# EAGLE schematic Station_lithobius_motenio_usb. (EAGLE 9.5.2)
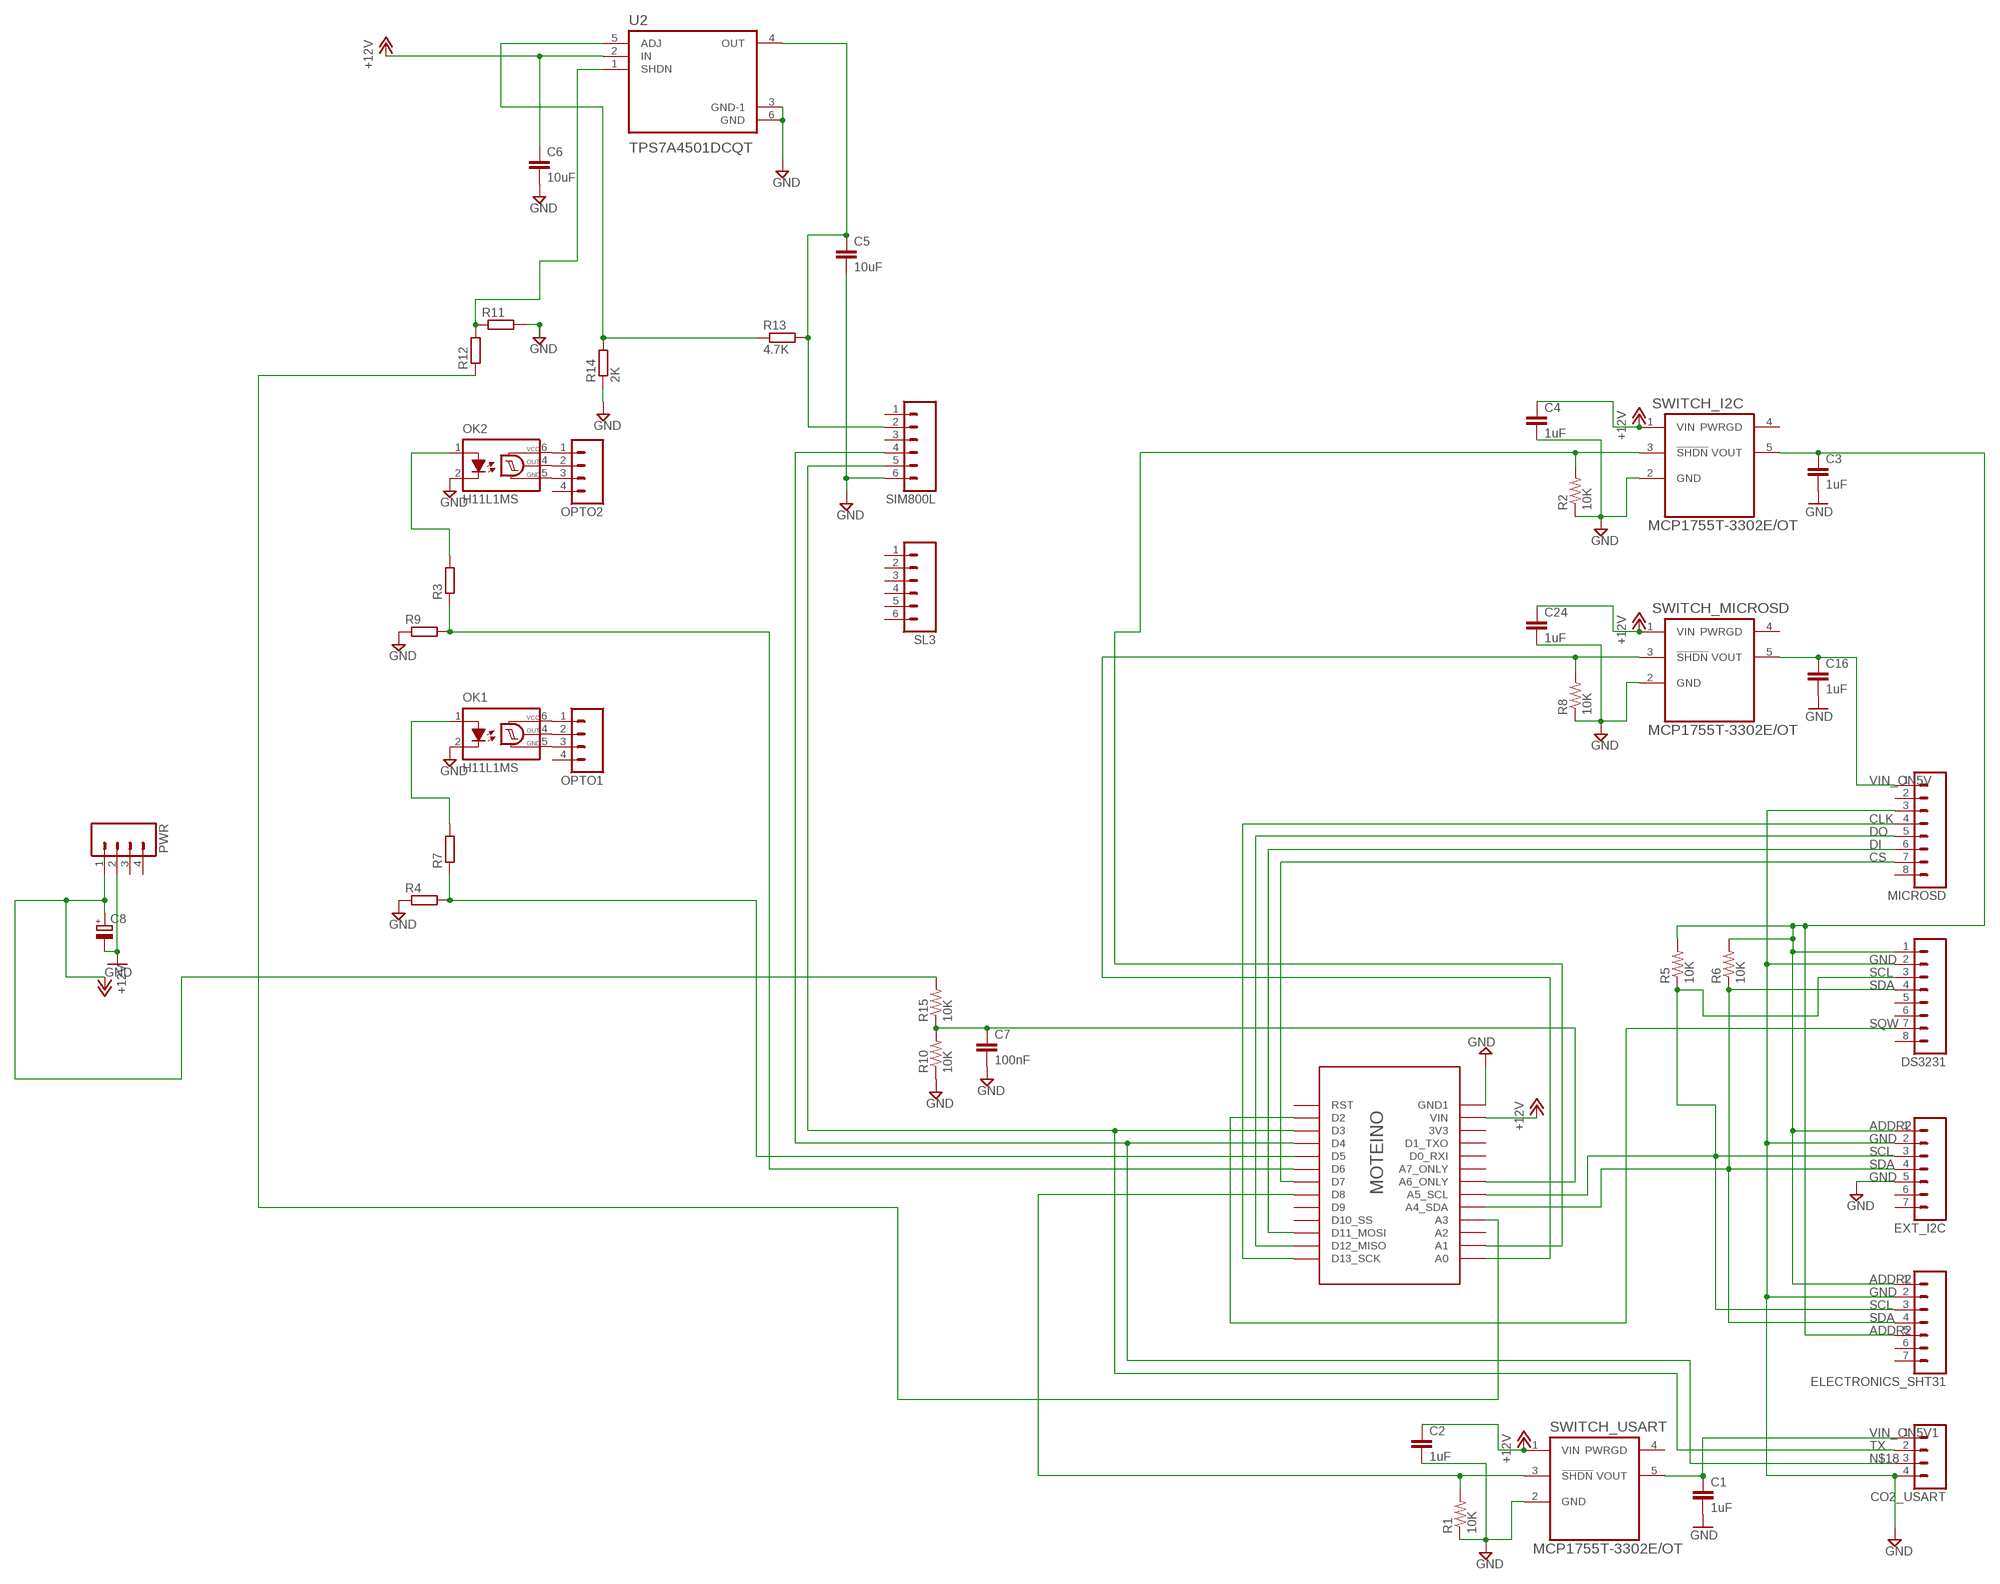
[diagram p0: schematic, sheet 1]

## Parts
C1  1uF  C-EUC0805K  [C0805K]
C2  1uF  C-EUC0805K  [C0805K]
C3  1uF  C-EUC0805K  [C0805K]
C4  1uF  C-EUC0805K  [C0805K]
C5  10uF  C-EUC0805K  [C0805K]
C6  10uF  C-EUC0805K  [C0805K]
C7  100nF  C-EUC0805K  [C0805K]
C8  CPOL-EU153CLV-0810  [153CLV-0810]
C16  1uF  C-EUC0805K  [C0805K]
C24  1uF  C-EUC0805K  [C0805K]
CO2_USART  M04  [04P]
DS3231  M08  [08P]
ELECTRONICS_SHT31  M07  [07P]
EXT_I2C  M07  [07P]
MICROSD  M08  [08P]
OK1  H11L1MS  [DIL6-SMD]
OK2  H11L1MS  [DIL6-SMD]
OPTO1  M04  [04P]
OPTO2  M04  [04P]
PWR  M04  [04P]
R1  10K  R-US_R2012W  [R2012W]
R2  10K  R-US_R2012W  [R2012W]
R3  R-EU_R0805  [R0805]
R4  R-EU_R0805  [R0805]
R5  10K  R-US_R2012W  [R2012W]
R6  10K  R-US_R2012W  [R2012W]
R7  R-EU_R0805  [R0805]
R8  10K  R-US_R2012W  [R2012W]
R9  R-EU_R0805  [R0805]
R10  10K  R-US_R2012W  [R2012W]
R11  R-EU_R0805  [R0805]
R12  R-EU_R0805  [R0805]
R13  4.7K  R-EU_R0805  [R0805]
R14  2K  R-EU_R0805  [R0805]
R15  10K  R-US_R2012W  [R2012W]
SIM800L  M06  [06P]
SL3  M06  [06P]
SWITCH_I2C  MCP1755T-3302E/OT  [SOT95P270X145-5N]
SWITCH_MICROSD  MCP1755T-3302E/OT  [SOT95P270X145-5N]
SWITCH_USART  MCP1755T-3302E/OT  [SOT95P270X145-5N]
U2  TPS7A4501DCQT  [SOT127P706X180-6N]
U$1  MOTEINO_SIMPLE  [MOTEINO_SIMPLE]

## Nets
+12V: C2.1 C4.1 C6.1 C8.+ C24.1 PWR.1 R15.2 SWITCH_I2C.1(VIN) SWITCH_MICROSD.1(VIN) SWITCH_USART.1(VIN) U2.2(IN) U$1.VIN
ADDR2: C3.1 DS3231.1 ELECTRONICS_SHT31.1 ELECTRONICS_SHT31.5 EXT_I2C.1 R5.2 R6.2 SWITCH_I2C.5(VOUT)
CLK: MICROSD.4 U$1.D13_SCK
CS: MICROSD.7 U$1.D7
DI: MICROSD.6 U$1.D11_MOSI
DO: MICROSD.5 U$1.D12_MISO
GND: C1.2 C2.2 C3.2 C4.2 C5.2 C6.2 C7.2 C8.- C16.2 C24.2 CO2_USART.4 DS3231.2 ELECTRONICS_SHT31.2 EXT_I2C.2 EXT_I2C.5 MICROSD.3 OK1.2(C) OK2.2(C) PWR.2 R1.1 R2.1 R4.1 R8.1 R9.1 R10.1 R11.2 R14.1 SIM800L.6 SWITCH_I2C.2(GND) SWITCH_MICROSD.2(GND) SWITCH_USART.2(GND) U2.3(GND-1) U2.6(GND) U$1.GND1
N$1: R11.1 R12.2 U2.1(SHDN)
N$2: R2.2 SWITCH_I2C.3(!SHDN) U$1.A1
N$3: R4.2 R7.1 U$1.D5
N$4: OK1.6(VCC) OPTO1.1
N$5: C7.1 R10.2 R15.1 U$1.A6_ONLY
N$6: R1.2 SWITCH_USART.3(!SHDN) U$1.D8
N$7: R3.1 R9.2 U$1.D6
N$8: OK1.4(OUT) OPTO1.2
N$9: OK1.5(GND) OPTO1.3
N$10: OK1.1(A) R7.2
N$11: R12.1 U$1.A3
N$12: OK2.6(VCC) OPTO2.1
N$13: OK2.4(OUT) OPTO2.2
N$15: C5.1 R13.2 SIM800L.2 U2.4(OUT)
N$16: R13.1 R14.2 U2.5(ADJ)
N$18: CO2_USART.3 SIM800L.4 U$1.D4
N$21: OK2.5(GND) OPTO2.3
N$25: OK2.1(A) R3.2
N$42: R8.2 SWITCH_MICROSD.3(!SHDN) U$1.A0
SCL: DS3231.3 ELECTRONICS_SHT31.3 EXT_I2C.3 R5.1 U$1.A5_SCL
SDA: DS3231.4 ELECTRONICS_SHT31.4 EXT_I2C.4 R6.1 U$1.A4_SDA
SQW: DS3231.7 U$1.D2
TX: CO2_USART.2 SIM800L.5 U$1.D3
VIN_ON5V: C16.1 MICROSD.1 SWITCH_MICROSD.5(VOUT)
VIN_ON5V1: C1.1 CO2_USART.1 SWITCH_USART.5(VOUT)
Unconnected: DS3231.5 DS3231.6 DS3231.8 ELECTRONICS_SHT31.6 ELECTRONICS_SHT31.7 EXT_I2C.6 EXT_I2C.7 MICROSD.2 MICROSD.8 OPTO1.4 OPTO2.4 PWR.3 PWR.4 SIM800L.1 SIM800L.3 SL3.1 SL3.2 SL3.3 SL3.4 SL3.5 SL3.6 SWITCH_I2C.4(PWRGD) SWITCH_MICROSD.4(PWRGD) SWITCH_USART.4(PWRGD) U$1.3V3 U$1.A2 U$1.A7_ONLY U$1.D0_RXI U$1.D1_TXO U$1.D9 U$1.D10_SS U$1.RST

## Library data of the parts
C1-C7 C16 C24 = resistor:C-EU: CAPACITOR, European symbol
C8 = resistor:CPOL-EU: POLARIZED CAPACITOR, European symbol
CO2_USART OPTO1 OPTO2 PWR = con-amp-quick:M04: AMP QUICK CONNECTOR; OC_FARNELL: unknown; OC_NEWARK: unknown
DS3231 MICROSD = con-amp-quick:M08: AMP QUICK CONNECTOR; OC_FARNELL: unknown; OC_NEWARK: unknown
ELECTRONICS_SHT31 EXT_I2C = con-amp-quick:M07: AMP QUICK CONNECTOR; OC_FARNELL: unknown; OC_NEWARK: unknown
OK1 OK2 = optocoupler:H11L*M: 6-Pin DIP Optocoupler Source: http://www.fairchildsemi.com/ds/H1/H11L2-M.pdf; OC_FARNELL: unknown; OC_NEWARK: unknown
R1 R2 R5 R6 R8 R10 R15 = resistor:R-US_: RESISTOR, American symbol
R3 R4 R7 R9 R11-R14 = rcl:R-EU_: RESISTOR, European symbol; SPICEPREFIX: R
SIM800L SL3 = con-amp-quick:M06: AMP QUICK CONNECTOR; OC_FARNELL: unknown; OC_NEWARK: unknown
SWITCH_I2C SWITCH_MICROSD SWITCH_USART = Microchip-MCP1755T:MCP1755T: 300 mA, 16V, High-Performance LDO, SOT23-5; MPN: MCP1755T-3302E/OT; OC_FARNELL: 2361992; OC_NEWARK: 31W8744; PACKAGE: SOT23-5; SUPPLIER: Microchip
U2 = TPS7A4501DCQT:TPS7A4501DCQT: None; AVAILABILITY: Unavailable; DESCRIPTION: Low-Noise Fast-Transient-Response 1.5-A Low-Dropout Voltage Regulator; DIGIKEY-PURCHASE-URL: https://snapeda.com/shop?store=DigiKey&id=548081; MF: Texas Instruments; MOUSER-PURCHASE-URL: https://snapeda.com/shop?store=Mouser&id=548081; MP: TPS7A4501DCQT; PACKAGE: SOT-223-6 Texas Instruments; PRICE: None; TEXAS_INSTRUMENTS-PURCHASE-URL: https://snapeda.com/shop?store=Texas+Instruments&id=548081
U$1 = Moteino:MOTEINO_SIMPLE